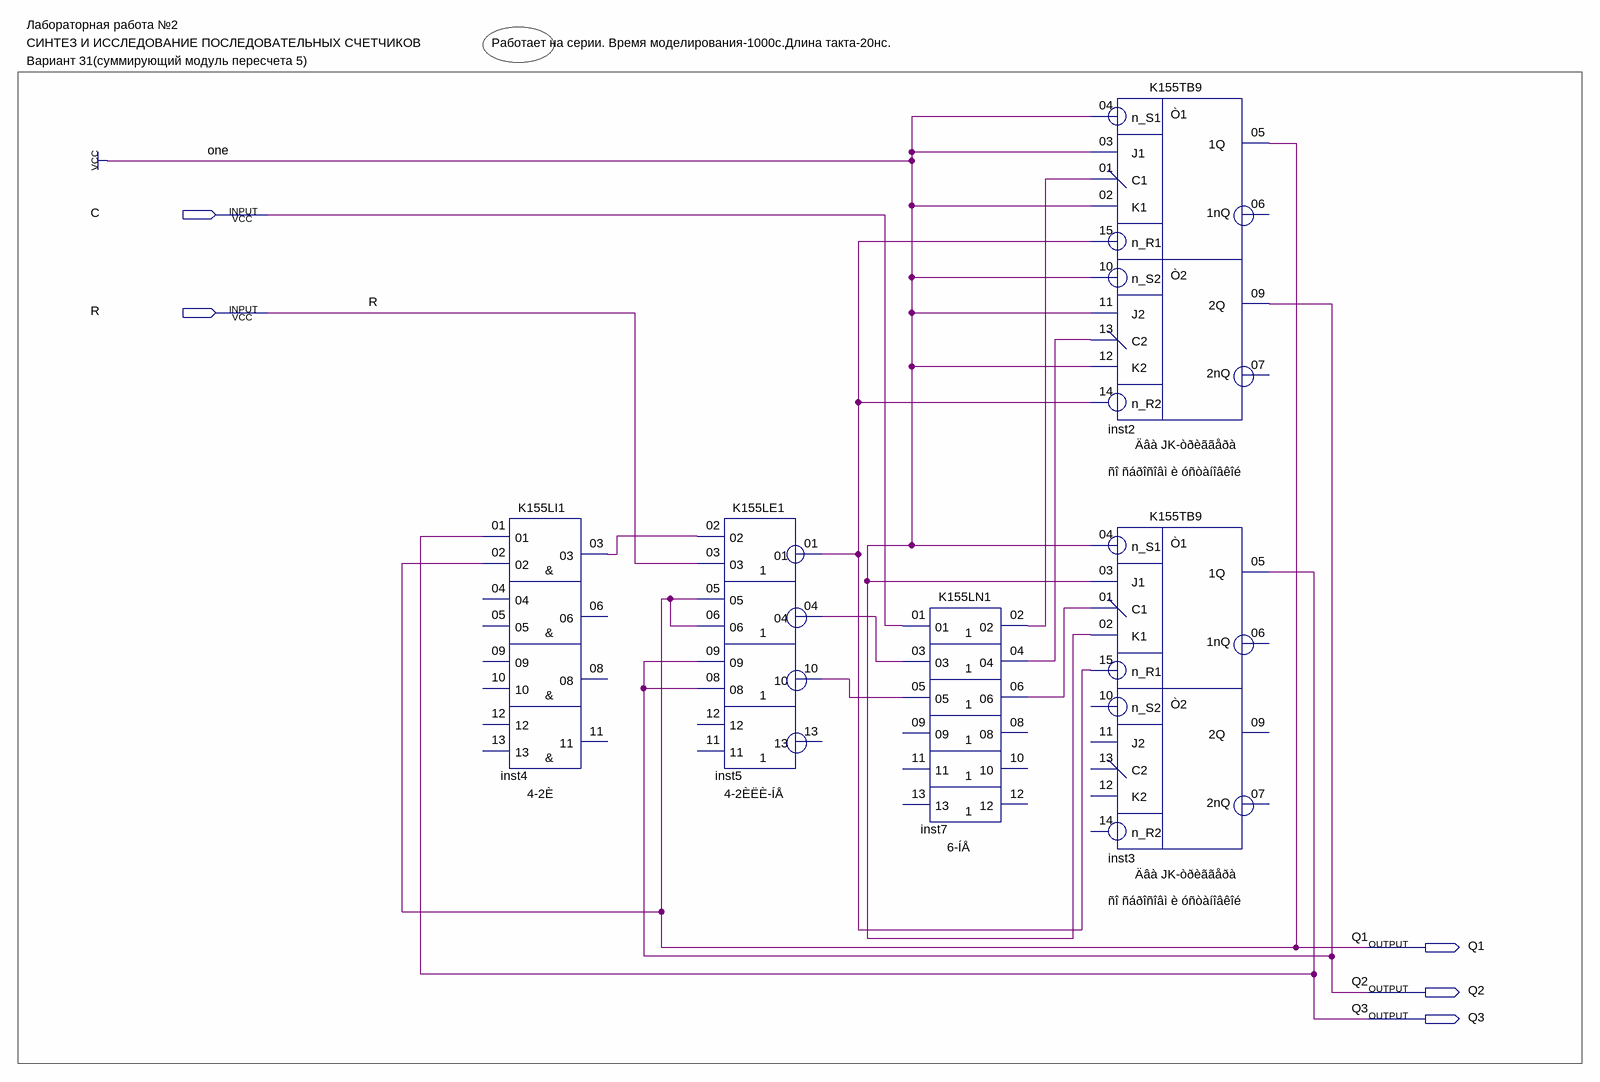
[diagram p0: schematic sheet]
// Quartus schematic 1_lab.bdf as structural Verilog: 5 symbols, 5 pins
module \1_lab  (
  input  C,
  input  R,
  output Q1,
  output Q2,
  output Q3
);

  wire inst4_03, inst5_01, inst5_04, inst5_10, inst7_02, inst7_04, inst7_06;

  K155LI1 inst4 (.\01 (Q3), .\02 (Q1), .\03 (inst4_03));  // open: 04, 05, 09, 10, 12, 13, 06, 08, 11
  K155LE1 inst5 (
    .\02 (inst4_03), .\03 (R), .\05 (Q1), .\06 (Q1), .\09 (Q2), .\08 (Q2), .\01 (inst5_01), .\04 (inst5_04),
    .\10 (inst5_10));  // open: 12, 11, 13
  K155LN1 inst7 (
    .\01 (C), .\03 (inst5_04), .\05 (inst5_10), .\02 (inst7_02), .\04 (inst7_04), .\06 (inst7_06));  // open: 09, 11, 13, 08, 10, 12
  K155TB9 inst2 (
    .n_S1(1'b1), .J1(1'b1), .n_R1(inst5_01), .C1(inst7_02), .K1(1'b1), .n_S2(1'b1), .J2(1'b1),
    .n_R2(inst5_01), .C2(inst7_04), .K2(1'b1), .\1Q (Q1), .\2Q (Q2));  // open: 1nQ, 2nQ
  K155TB9 inst3 (
    .n_S1(1'b1), .J1(1'b1), .n_R1(inst5_01), .C1(inst7_06), .K1(1'b1), .\1Q (Q3));  // open: n_S2, J2, n_R2, C2, K2, 1nQ, 2Q, 2nQ

  // Notes on the sheet:
  //   Лабораторная работа №2
  //   СИНТЕЗ И ИССЛЕДОВАНИЕ ПОСЛЕДОВАТЕЛЬНЫХ СЧЕТЧИКОВ
  //   Работает на серии. Время моделирования-1000с.Длина такта-20нс.
  //   Вариант 31(суммирующий модуль пересчета 5)
endmodule
